# Altium schematic sheet Pixy2Carrier.SchDoc
size A; SheetNumber: 1; SheetTotal: 1
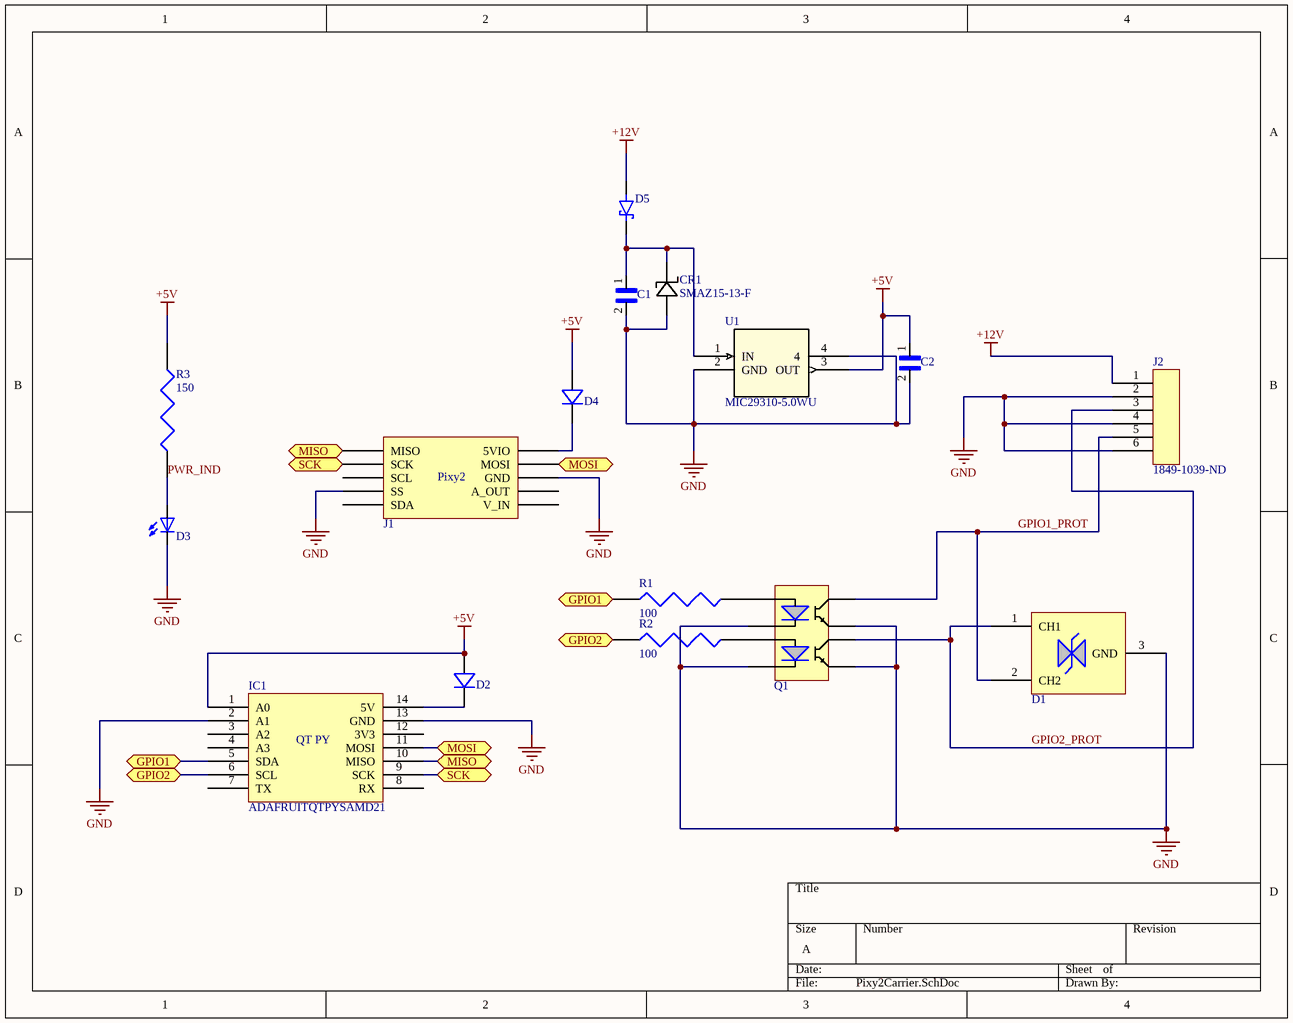
[diagram p0: Pixy2Carrier.SchDoc]

## Parts
C1  CL21A106KOQNNNG  [CAPC2012X140N]  (value not drawn)
C2  CL21A106KOQNNNG  [CAPC2012X140N]  (value not drawn)
CR1  SMAZ15-13-F  [SMA_DIO]
D1  D1213A-02SOL-7  [SOT23-3]  (value not drawn)
D2  LSM115JE3/TR13  [DO-214BA_MCH]  (value not drawn)
D3  LTST-C171KGKT  [DIOC200X125X110]  (value not drawn)
D4  LSM115JE3/TR13  [DO-214BA_MCH]  (value not drawn)
D5  SK34A  [DIOM4325X250N]  (value not drawn)
IC1  ADAFRUITQTPYSAMD21  [ADAFRUITQTPYSAMD21]
J1  PIXY2  [PIXY2]  (value not drawn)
J2  Supplier Part Number 1: 1849-1039-ND  [AST2130602]  (hidden comment: AST2130602)
Q1  LTV-827S-TA1  [LTV-827S-TA1]  (value not drawn)
R1  100  [RMCF0805FT]
R2  100  [RMCF0805FT]
R3  150  [RMCF0805FT]
U1  MIC29310-5.0WU  [TO-263-3_MCL]

## Ports
GPIO1 (bidir), GPIO2 (bidir), MISO (bidir), MOSI (bidir), SCK (bidir)

## Nets
+5V: C2.1 D2.2 D4.2 IC1.1(A0) R3.2 U1.3(OUT)
+12V: D5.A J2.1
GND: C1.2 C2.2 CR1.2 D1.3(GND) D3.NEG IC1.2(A1) IC1.13(GND) J1.6(GND) J1.7(SS) J2.2 J2.4 J2.6 Q1.2 Q1.4 Q1.5 Q1.7 U1.2(GND) U1.4
GPIO1: IC1.5(SDA) R1.1 ; port GPIO1
GPIO1_PROT: D1.2(CH2) J2.5 Q1.8
GPIO2: IC1.6(SCL) R2.1 ; port GPIO2
GPIO2_PROT: D1.1(CH1) J2.3 Q1.6
MISO: IC1.10(MISO) J1.1(MISO) ; port MISO
MOSI: IC1.11(MOSI) J1.4(MOSI) ; port MOSI
PWR_IND: D3.POS R3.1
SCK: IC1.9(SCK) J1.3(SCK) ; port SCK
NetC1_1: C1.1 CR1.1 D5.C(K) U1.1(IN)
NetD2_1: D2.1 IC1.14(5V)
NetD4_1: D4.1 J1.2(5VIO)
NetQ1_1: Q1.1 R1.2
NetQ1_3: Q1.3 R2.2

Not connected (* = marked no-connect by the designer): IC1 3(A2) 4(A3) 7(TX) 8(RX) 12(3V3); J1 5(SCL) 8(A_OUT) 9(SDA) 10(V_IN)

## Notes on the sheet
- (in symbol ADAFRUITQTPYSAMD21) QT PY
- (in symbol PIXY2) Pixy2

## Library data of the parts
C1 C2 = CL21A106KOQNNNG: 10ÂµF Â±10% 16V Ceramic Capacitor X5R 0805 _2012 Metric_; MF: Samsung Electro-Mechanics; Package: 0805 Samsung; Digi-Key_Part_Number: 1276-6455-1-ND; Digi-Key_Purchase_URL: https://www.digikey.com/product-detail/en/samsung-electro-mechanics/CL21A106KOQNNNG/1276-6455-1-ND/5958083?utm_source=snapeda&utm_medium=aggregator&utm_campaign=symbol; Value: *; MP: CL21A106KOQNNNG; SnapEDA_Link: https://www.snapeda.com/parts/CL21A106KOQNNNG/Samsung%20Electro-Mechanics/view-part/3597829/?ref=snap
CR1 = SMAZ15-13-F: No Description Available; Mfr_Name: Diodes Inc; Type: DEV; Copyright: Copyright (C) 2022 Ultra Librarian. All rights reserved.; Manufacturer_Part_Number: SMAZ15-13-F; Digi-Key_Part_Number_1: SMAZ15-FDICT-ND; Digi-Key_Part_Number_2: SMAZ15-FDIDKR-ND; Digi-Key_Part_Number_3: SMAZ15-FDITR-ND; RefDes: RefDes
D1 = D1213A-02SOL-7: 2 Channel 6 V 0.85 pF Surface Mount TVS Diode Array - SOT-23; Manufacturer: Diodes; Capacitance: 1.2pF; Direction: Unidirectional; Max Surge Current: 5A; Number of Channels: 2; Working Voltage: 3.3V; Breakdown Voltage: 6V; Clamping Voltage: 10V; Max Power Dissipation: 300mW; Power Line Protection: Yes; Leakage Current: 1uA; Test Current: 1mA; Element Configuration: Dual; Peak Pulse Current: 1A; Supplier 1: Digi-Key; Manufacturer Part Number: D1213A-02SOL-7; RoHS: Yes; Category: TVS Diodes; Stock 1: 50803; Pricing 1: 3000=0.08910, 6000=0.08415, 15000=0.07673, 30000=0.07515 (USD); Mount: Surface Mount; Case/Package: SOT-23; Number of Pins: 3; Contact Plating: Tin,Matte; Min Operating Temperature: -65°C; Max Operating Temperature: 150°C; Packaging: Tape and Reel; Package Quantity: 3000; Polarity: Unidirectional; Termination: SMD/SMT; Number of Bidirectional Channels: 2; Reverse Standoff Voltage: 3.3V; Min Breakdown Voltage: 6V; ESD Protection: Yes; Max Reverse Leakage Current: 1uA; Series: -; Length: 2.9mm; Width: 1.4mm; Height: 1.1mm; Depth: 1.3mm; Radiation Hardening: No; REACH SVHC: No SVHC; Lead Free: Lead Free; ComponentLink1URL: https://datasheet.ciiva.com/12326/d1213a-02sol-219080-12326802.pdf?src-supplier=Mouser; ComponentLink1Description: https://datasheet.ciiva.com/12326/d1213a-02sol-219080-12326802.pdf?src-supplier=Mouser; ComponentLink2URL: https://datasheet.ciiva.com/6574/d1213a-02sol-6574184.pdf?src-supplier=Digi-Key; ComponentLink2Description: https://datasheet.ciiva.com/6574/d1213a-02sol-6574184.pdf?src-supplier=Digi-Key; ComponentLink3URL: https://datasheet.ciiva.com/15186/getdatasheetpartid-670825-15186721.pdf?src-supplier=Verical; ComponentLink3Description: https://datasheet.ciiva.com/15186/getdatasheetpartid-670825-15186721.pdf?src-supplier=Verical; ComponentLink4URL: https://datasheet.ciiva.com/30478/0900766b8115c333-30478825.pdf?src-supplier=RSComponents; ComponentLink4Description: https://datasheet.ciiva.com/30478/0900766b8115c333-30478825.pdf?src-supplier=RSComponents; Supplier Part Number 1: D1213A-02SOL-7DITR-ND
D2 D4 = LSM115JE3/TR13: No Description Available; Mfr_Name: Microchip; Type: DEV; Copyright: Copyright (C) 2022 Ultra Librarian. All rights reserved.; Manufacturer_Part_Number: LSM115JE3/TR13; Digi-Key_Part_Number_1: LSM115JE3/TR13TR-ND; Digi-Key_Part_Number_2: LSM115JE3/TR13CT-ND; Digi-Key_Part_Number_3: LSM115JE3/TR13DKR-ND; RefDes: RefDes
D3 = LTST-C171KGKT: Green 2 x 1.25 x 1.1 mm 130Â° Water Clear 35 mcd 2 V Surface Mount LED; MF: {'manufacturer': u'Lite-On Inc.'}; Value: *; MP: LTST-C171KGKT; Availability: Unavailable; Package: None; Price: None
J1 = PIXY2: Female, 5 C, Straight, .100"CC; 3.20mm Tail, No Mounting; PBT, Phos. Bronze, 105 C; Manufacturer: Sullins; Manufacturer Part Number: PPPC051LFBN-RC; Number of Positions: 5; Connector Type: Header; Pitch: 0.1inch; RoHS: Yes; Category: Connectors; Stock 1: 84206; Pricing 1: 1=0.49000, 10=0.42700, 80=0.35188, 440=0.30600, 1000=0.25245, 5000=0.22185, 10000=0.22100 (USD); Mount: Through Hole; Color: Black; Contact Plating: Gold; Contact Material: Bronze; Housing Material: Plastic; Package Quantity: 1000; Number of Rows: 1; Packaging: Bulk; Termination: Solder; Contact Type: Female Socket; Length: 13.2mm; Width: 2.5mm; Height: 8.5mm; Lead Free: Lead Free; RoHS Compliant: Yes; ComponentLink1URL: https://media.digikey.com/pdf/Data%20Sheets/Sullins%20PDFs/Female_Headers.100_DS.pdf?src-supplier=Digi-Key; ComponentLink1Description: https://media.digikey.com/pdf/Data%20Sheets/Sullins%20PDFs/Female_Headers.100_DS.pdf?src-supplier=Digi-Key; ComponentLink2URL: http://www.sullinscorp.com/catalogs/78_Page80-81_HEADER_.100_2.54mm_FEMALE.pdf?src-supplier=Future+Electronics; ComponentLink2Description: http://www.sullinscorp.com/catalogs/78_Page80-81_HEADER_.100_2.54mm_FEMALE.pdf?src-supplier=Future+Electronics; Supplier 1: Digi-Key; Supplier Part Number 1: S9194-ND
J2 = AST2130602: Conn PC Terminal Block 6 POS 3.5mm Solder ST Thru-Hole 6A/Contact Box/Carton; Manufacturer: METZ CONNECT USA Inc.; Connector Type: Receptacle,Connector; Sealable: No (Without); Contact Current Rating: 6A; Wire/Cable Gauge: 14AWG; Approvals: UL; Supplier 1: Digi-Key; Manufacturer Part Number: AST2130602; RoHS: No; Category: Terminal Blocks; Stock 1: 4797; Pricing 1: 1=1.42000, 10=1.00100, 25=0.93320, 50=0.84700, 100=0.84320, 250=0.71200, 500=0.67454, 1000=0.59959, 5000=0.49966 (USD); Number of Pins: 6; Contact Plating: Tin,Lead; Packaging: Box; Termination: Through Hole; Lead Free: Lead Free; ComponentLink1URL: https://www.digikey.com/en/products/detail/metz-connect-usa-inc/AST2130602/7794804; ComponentLink1Description: https://www.digikey.com/en/products/detail/metz-connect-usa-inc/AST2130602/7794804
Q1 = LTV-827S-TA1: LTV Series Dual Channel 35 V 5000 Vrms Transistor Output Optocoupler SMT - DIP-8; Manufacturer: Vishay Lite-On; Number of Channels: 2; Collector Emitter Voltage (VCEO): 35V; Output Current per Channel: 50mA; Collector Emitter Saturation Voltage: 200mV; Input Type: DC; Max Power Dissipation: 200mW; Current Transfer Ratio: 600%; Forward Voltage: 1.4V; Rise Time: 18000ns; Isolation Voltage: 5kV; Reverse Breakdown Voltage: 6V; Supplier 1: Digi-Key; Manufacturer Part Number: LTV-827S-TA1; RoHS: Yes; Category: Optocouplers; Stock 1: 113; Pricing 1: 1=0.54000, 10=0.35400, 100=0.23440 (USD); Mount: Surface Mount; Case/Package: SMD/SMT; Number of Pins: 8; Min Operating Temperature: -30°C; Max Operating Temperature: 110°C; Packaging: Tape and Reel; Package Quantity: 1000; Series: -; Collector-emitter Voltage-Max: 200mV; Output Voltage: 35V; Forward Current: 50mA; Max Output Voltage: 35V; Max Collector Current: 50mA; Max Input Current: 50mA; Number of Elements: 2; Power Dissipation: 200mW; Number of Circuits: 2; Fall Time: 18000ns; Isolation Voltage-Max: 5kV; Radiation Hardening: No; Lead Free: Lead Free; RoHS Compliant: Yes; ComponentLink1URL: https://datasheet.ciiva.com/15119/getdatasheetpartid-293602-15119006.pdf?src-supplier=Verical; ComponentLink1Description: https://datasheet.ciiva.com/15119/getdatasheetpartid-293602-15119006.pdf?src-supplier=Verical; ComponentLink2URL: https://datasheet.ciiva.com/6578/s-110-ltv-817827847m-s-s-ta-s-ta1-s-tpseries-6578486.pdf?src-supplier=Digi-Key; ComponentLink2Description: https://datasheet.ciiva.com/6578/s-110-ltv-817827847m-s-s-ta-s-ta1-s-tpseries-6578486.pdf?src-supplier=Digi-Key; ComponentLink3URL: https://datasheet.ciiva.com/6578/s-110-ltv-817827847m-s-s-ta-s-ta1-s-tpseries-6578487.pdf?src-supplier=Digi-Key; ComponentLink3Description: https://datasheet.ciiva.com/6578/s-110-ltv-817827847m-s-s-ta-s-ta1-s-tpseries-6578487.pdf?src-supplier=Digi-Key; ComponentLink4URL: https://datasheet.ciiva.com/6578/s-110-ltv-817827847m-s-s-ta-s-ta1-s-tpseries-6578488.pdf?src-supplier=Digi-Key; ComponentLink4Description: https://datasheet.ciiva.com/6578/s-110-ltv-817827847m-s-s-ta-s-ta1-s-tpseries-6578488.pdf?src-supplier=Digi-Key; ComponentLink5URL: https://datasheet.ciiva.com/12241/ltv-817-827-847-12241821.pdf?src-supplier=Mouser; ComponentLink5Description: https://datasheet.ciiva.com/12241/ltv-817-827-847-12241821.pdf?src-supplier=Mouser; ComponentLink6URL: https://datasheet.ciiva.com/16448/ltv-817-827-847-16448540.pdf?src-supplier=Future+Electronics; ComponentLink6Description: https://datasheet.ciiva.com/16448/ltv-817-827-847-16448540.pdf?src-supplier=Future+Electronics; Supplier Part Number 1: 160-2040-1-ND
R1 R2 = RMCF0805FT100R: Res Thick Film 0805 100 Ohm 1% 0.125W ±100ppm/°C Molded SMD Paper T/R; Manufacturer: Stackpole Electronics; Resistance: 100R; Power Rating: 250mW; Max Power Dissipation: 125mW; Supplier 1: Digi-Key; Manufacturer Part Number: RMCF0805FT100R; RoHS: Yes; Category: Chip SMD Resistors; Stock 1: 188; Pricing 1: 1=0.10000, 10=0.02700, 100=0.01090, 1000=0.00488, 2500=0.00423 (USD); Mount: Surface Mount; Case/Package: 0805; Case Code (Metric): 2012; Case Code (Imperial): 0805; Contact Plating: Tin,Matte; Size Code: 0805; Min Operating Temperature: -55°C; Max Operating Temperature: 155°C; Tolerance: 1%; Packaging: Tape and Reel; Resistor Type: Thick Film; Number of Terminations: 2; Temperature Coefficient: 100ppm/°C; Features: Automotive AEC-Q200; Series: RMCF; Construction: Rectangular; Length: 2mm; Width: 0.049inch; Height: 0.026inch; Depth: 1.25mm; Radiation Hardening: No; Lead Free: Lead Free; Military Standard: Not; RoHS Compliant: Yes; ComponentLink1URL: http://components.arrow.com/part/dataview/44988339S7171742N1174?src-supplier=Arrow+Electronics; ComponentLink1Description: http://components.arrow.com/part/dataview/44988339S7171742N1174?src-supplier=Arrow+Electronics; ComponentLink2URL: https://www.seielect.com/catalog/SEI-Packaging.pdf?src-supplier=Digi-Key; ComponentLink2Description: https://www.seielect.com/catalog/SEI-Packaging.pdf?src-supplier=Digi-Key; ComponentLink3URL: https://www.seielect.com/catalog/SEI-RMCF_RMCP.pdf?src-supplier=Avnet; ComponentLink3Description: https://www.seielect.com/catalog/SEI-RMCF_RMCP.pdf?src-supplier=Avnet; ComponentLink4URL: https://www.verical.com/server-webapp/html/getDatasheet?partID=359908&src-supplier=Verical; ComponentLink4Description: https://www.verical.com/server-webapp/html/getDatasheet?partID=359908&src-supplier=Verical; ComponentLink5URL: http://www.seielect.com/Catalog/SEI-RMC.pdf?src-supplier=Future+Electronics; ComponentLink5Description: http://www.seielect.com/Catalog/SEI-RMC.pdf?src-supplier=Future+Electronics; Supplier Part Number 1: RMCF0805FT100RCT-ND
R3 = RMCF0805FT150R: Res Thick Film 0805 150 Ohm 1% 0.125W(1/8W) ±100ppm/C Pad SMD Automotive T/R; Manufacturer: Stackpole Electronics; Resistance: 150R; Power Rating: 125mW; Temperature Coefficient: 100ppm/°C; Supplier 1: Avnet; Manufacturer Part Number: RMCF0805FT150R; RoHS: Yes; Category: Chip SMD Resistors; Stock 1: 315000; Pricing 1: 5000=0.00256, 10000=0.00252, 20000=0.00245, 30000=0.00239, 40000=0.00230, 50000=0.00225, 500000=0.00220 (USD); Mount: Surface Mount; Case/Package: 0805; Case Code (Metric): 2012; Case Code (Imperial): 0805; Contact Plating: Tin,Matte; Min Operating Temperature: -55°C; Max Operating Temperature: 155°C; Packaging: Tape and Reel; Tolerance: 1%; Resistor Type: Thick Film; Number of Terminations: 2; Max Power Dissipation: 125mW; Features: Automotive AEC-Q200; Series: RMCF; Construction: Rectangular; Length: 2mm; Width: 0.049inch; Height: 0.026inch; Depth: 1.25mm; Radiation Hardening: No; Military Standard: Not; RoHS Compliant: Yes; ComponentLink1URL: http://components.arrow.com/part/dataview/44988385S7171757N1174?src-supplier=Arrow+Electronics; ComponentLink1Description: http://components.arrow.com/part/dataview/44988385S7171757N1174?src-supplier=Arrow+Electronics; ComponentLink2URL: https://www.seielect.com/catalog/SEI-Packaging.pdf?src-supplier=Digi-Key; ComponentLink2Description: https://www.seielect.com/catalog/SEI-Packaging.pdf?src-supplier=Digi-Key; ComponentLink3URL: https://www.seielect.com/catalog/SEI-RMCF_RMCP.pdf?src-supplier=Avnet; ComponentLink3Description: https://www.seielect.com/catalog/SEI-RMCF_RMCP.pdf?src-supplier=Avnet; ComponentLink4URL: https://www.seielect.com/catalog/SEI-RMCF_RMCP.pdf?src-supplier=Avnet+Asia; ComponentLink4Description: https://www.seielect.com/catalog/SEI-RMCF_RMCP.pdf?src-supplier=Avnet+Asia; ComponentLink5URL: https://www.verical.com/server-webapp/html/getDatasheet?partID=375102&src-supplier=Verical; ComponentLink5Description: https://www.verical.com/server-webapp/html/getDatasheet?partID=375102&src-supplier=Verical; Supplier Part Number 1: RMCF0805FT150R
U1 = MIC29310-5.0WU: No Description Available; Mfr_Name: Micrel; Copyright: Copyright (C) 2022 Ultra Librarian. All rights reserved.; Manufacturer_Part_Number: MIC29310-5.0WU; Digi-Key_Part_Number_1: 576-2230-ND; Digi-Key_Part_Number_2: MIC29310-5.0WU-CRL-ND; RefDes: RefDes; Type: DEV
D5 = SK34A: Price: None; Availability: Unavailable; Value: *; MP: SK34A; Package: None